# Altium schematic sheet kopplingsschema_tempsensor.SchDoc
size A4
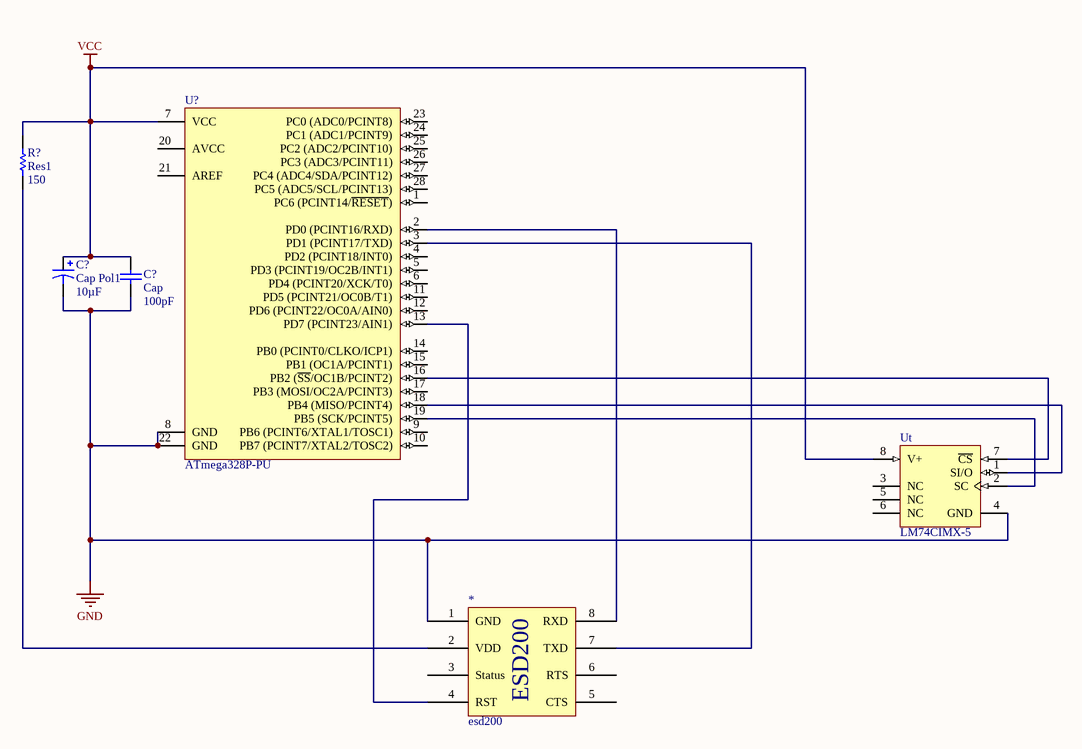
[diagram p0: kopplingsschema_tempsensor.SchDoc]

## Parts
(Parts that share a designator on the sheet are numbered #1, #2 ... from top to bottom, then left to right.)
*  esd200
C?#1  Cap Pol1  value 10µF  [RB7.6-15]
C?#2  Cap  value 100pF  [RAD-0.3]
R?  Res1  value 150  [AXIAL-0.3]
U?  ATmega328P-PU  [28P3]
Ut  LM74CIMX-5  [M08A_N]

## Nets
GND: *.1(GND) C?#1.2 C?#2.1 U?.8(GND) U?.22(GND) Ut.4(GND)
VCC: C?#1.1 C?#2.2 R?.2 U?.7(VCC) Ut.8(V+)
Net*_2: *.2(VDD) R?.1
Net*_4: *.4(RST) U?.13(PD7_(PCINT23/AIN1))
Net*_7: *.7(TXD) U?.3(PD1_(PCINT17/TXD))
Net*_8: *.8(RXD) U?.2(PD0_(PCINT16/RXD))
NetU?_16: U?.16(PB2_(~{SS}/OC1B/PCINT2)) Ut.7(~{CS})
NetU?_18: U?.18(PB4_(MISO/PCINT4)) Ut.1(SI/O)
NetU?_19: U?.19(PB5_(SCK/PCINT5)) Ut.2(SC)

Not connected (* = marked no-connect by the designer): * 3(Status) 5(CTS) 6(RTS); U? 1(PC6_(PCINT14/~{RESET})) 4(PD2_(PCINT18/INT0)) 5(PD3_(PCINT19/OC2B/INT1)) 6(PD4_(PCINT20/XCK/T0)) 9(PB6_(PCINT6/XTAL1/TOSC1)) 10(PB7_(PCINT7/XTAL2/TOSC2)) 11(PD5_(PCINT21/OC0B/T1)) 12(PD6_(PCINT22/OC0A/AIN0)) 14(PB0_(PCINT0/CLKO/ICP1)) 15(PB1_(OC1A/PCINT1)) 17(PB3_(MOSI/OC2A/PCINT3)) 20(AVCC) 21(AREF) 23(PC0_(ADC0/PCINT8)) 24(PC1_(ADC1/PCINT9)) 25(PC2_(ADC2/PCINT10)) 26(PC3_(ADC3/PCINT11)) 27(PC4_(ADC4/SDA/PCINT12)) 28(PC5_(ADC5/SCL/PCINT13)); Ut 3(NC) 5(NC) 6(NC)

## Notes on the sheet
- (in symbol esd200) ESD200

## Library data of the parts
C?#1 = Cap Pol1: Polarized Capacitor (Radial); Published: 8-Jun-2000; LatestRevisionDate: 17-Jul-2002; LatestRevisionNote: Re-released for DXP Platform.; PackageReference: RB7.6-15; Publisher: Altium Limited; PackageDescription: Polarized Capacitor (Radial); 2 Leads
C?#2 = Cap: Capacitor; Published: 8-Jun-2000; LatestRevisionDate: 17-Jul-2002; LatestRevisionNote: Re-released for DXP Platform.; PackageReference: RAD-0.3; Publisher: Altium Limited; PackageDescription: Radial Cap, Thru-Hole; 2 Leads; 0.3 in Pin Spacing
R? = Res1: Resistor; Published: 8-Jun-2000; LatestRevisionDate: 17-Jul-2002; LatestRevisionNote: Re-released for DXP Platform.; PackageReference: AXIAL-0.3; Publisher: Altium Limited; PackageDescription: Axial Device, Thru-Hole; 2 Leads; 0.3 in Pin Spacing
U? = ATmega328P-PU: 8-bit AVR Microcontroller, 32KB Flash, 1KB EEPROM, 2KB SRAM, 28-pin PDIP, Industrial Grade (-40°C to 85°C); Published: 1-Apr-2010; DatasheetVersion: revA, Jan-2010; PackageVersion: revB, Sep-2001; PackageReference: 28P3; Publisher: Altium Limited; PackageDescription: 28-lead (0.300"/7.62mm Wide) Plastic Dual Inline Package (PDIP); Supplier 1: Digi-Key; Supplier Part Number 1: ATMEGA328P-PU-ND; Supplier 2: Farnell; Supplier Part Number 2: 1715487; Supplier 3: Mouser; Supplier Part Number 3: 556-ATMEGA328P-PU; ComponentLink1Description: Manufacturer Link; ComponentLink1URL: http://www.atmel.com/products/avr/default.asp?; ComponentLink2Description: ATmega48A/48PA/88A/88PA/168A/168PA/328/328P Datasheet; ComponentLink2URL: http://www.atmel.com/dyn/resources/prod_documents/8271.pdf; ComponentLink3Description: ATmega48A/48PA/88A/88PA/168A/168PA/328/328P Summary; ComponentLink3URL: http://www.atmel.com/dyn/resources/prod_documents/8271S.pdf; ComponentLink4Description: Atmel.com Home; ComponentLink4URL: http://www.atmel.com
Ut = LM74CIMX-5: SPI/MICROWIRE 12-Bit Plus Sign Temperature Sensor, 8-pin Narrow SOIC; Manufacturer: National Semiconductor; PackageTopMarking: NSZXTT*LM74*CIM5; PowerWise: N; CompType: Temp Sensor IC; Published: 1-Mar-2010; DatasheetVersion: May-2005; PackageVersion: revM, May-2009; PackageReference: M08A; Publisher: Altium Limited; PackageDescription: SOIC Narrow, 4.9 x 3.9 x 1.45mm, 8 Lead, 1.27mm Pitch; PartNumber: LM74CIMX-5; RoHS: N; PinCount: 8; ComponentLink1Description: LM74 Datasheet; ComponentLink1URL: http://www.national.com/ds/LM/LM74.pdf; ComponentLink2Description: LM74 Web Page; ComponentLink2URL: http://www.national.com/pf/LM/LM74.html; ComponentLink3Description: M08A Package Page; ComponentLink3URL: http://www.national.com/packaging/folders/m08a.html; Code_JEDEC: MS-012-AA; Code_IPC: SOIC127P600-8